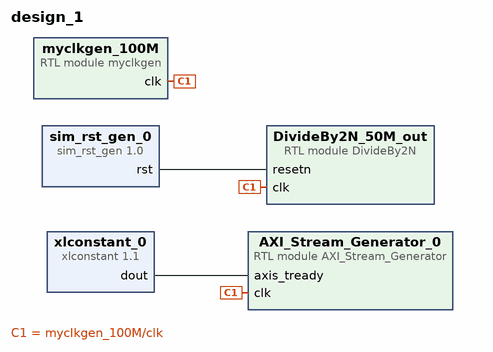
[diagram p0: block diagram of the top level]
# Vivado block design design_1, xc7z010clg400-1, Vivado 2022.2
create_bd_design design_1

create_bd_cell -type module -reference myclkgen myclkgen_100M
create_bd_cell -type module -reference DivideBy2N DivideBy2N_50M_out
set_property -dict {CONFIG.N 1 CONFIG.WIDTH 2} [get_bd_cells DivideBy2N_50M_out]
create_bd_cell -type ip -vlnv xilinx.com:ip:sim_rst_gen:1.0 sim_rst_gen_0
create_bd_cell -type module -reference AXI_Stream_Generator AXI_Stream_Generator_0
set_property -dict [list \
  CONFIG.DATA_0 0x00000002 \
  CONFIG.DATA_1 0x00000004 \
  CONFIG.DATA_2 0x00000008 \
  CONFIG.DATA_3 0x00000000 \
  CONFIG.TIMEOUT_0 10000 \
  CONFIG.TIMEOUT_1 10000 \
  CONFIG.TIMEOUT_2 10000 \
  CONFIG.TIMEOUT_3 10000 \
] [get_bd_cells AXI_Stream_Generator_0]
create_bd_cell -type ip -vlnv xilinx.com:ip:xlconstant:1.1 xlconstant_0

# ---- connections ----

connect_bd_net -net myclkgen_0_clk [get_bd_pins myclkgen_100M/clk] [get_bd_pins DivideBy2N_50M_out/clk] [get_bd_pins AXI_Stream_Generator_0/clk]
connect_bd_net [get_bd_pins sim_rst_gen_0/rst] [get_bd_pins DivideBy2N_50M_out/resetn]
connect_bd_net [get_bd_pins xlconstant_0/dout] [get_bd_pins AXI_Stream_Generator_0/axis_tready]

validate_bd_design
save_bd_design
